# EAGLE design Radio (EAGLE 7.4.0)
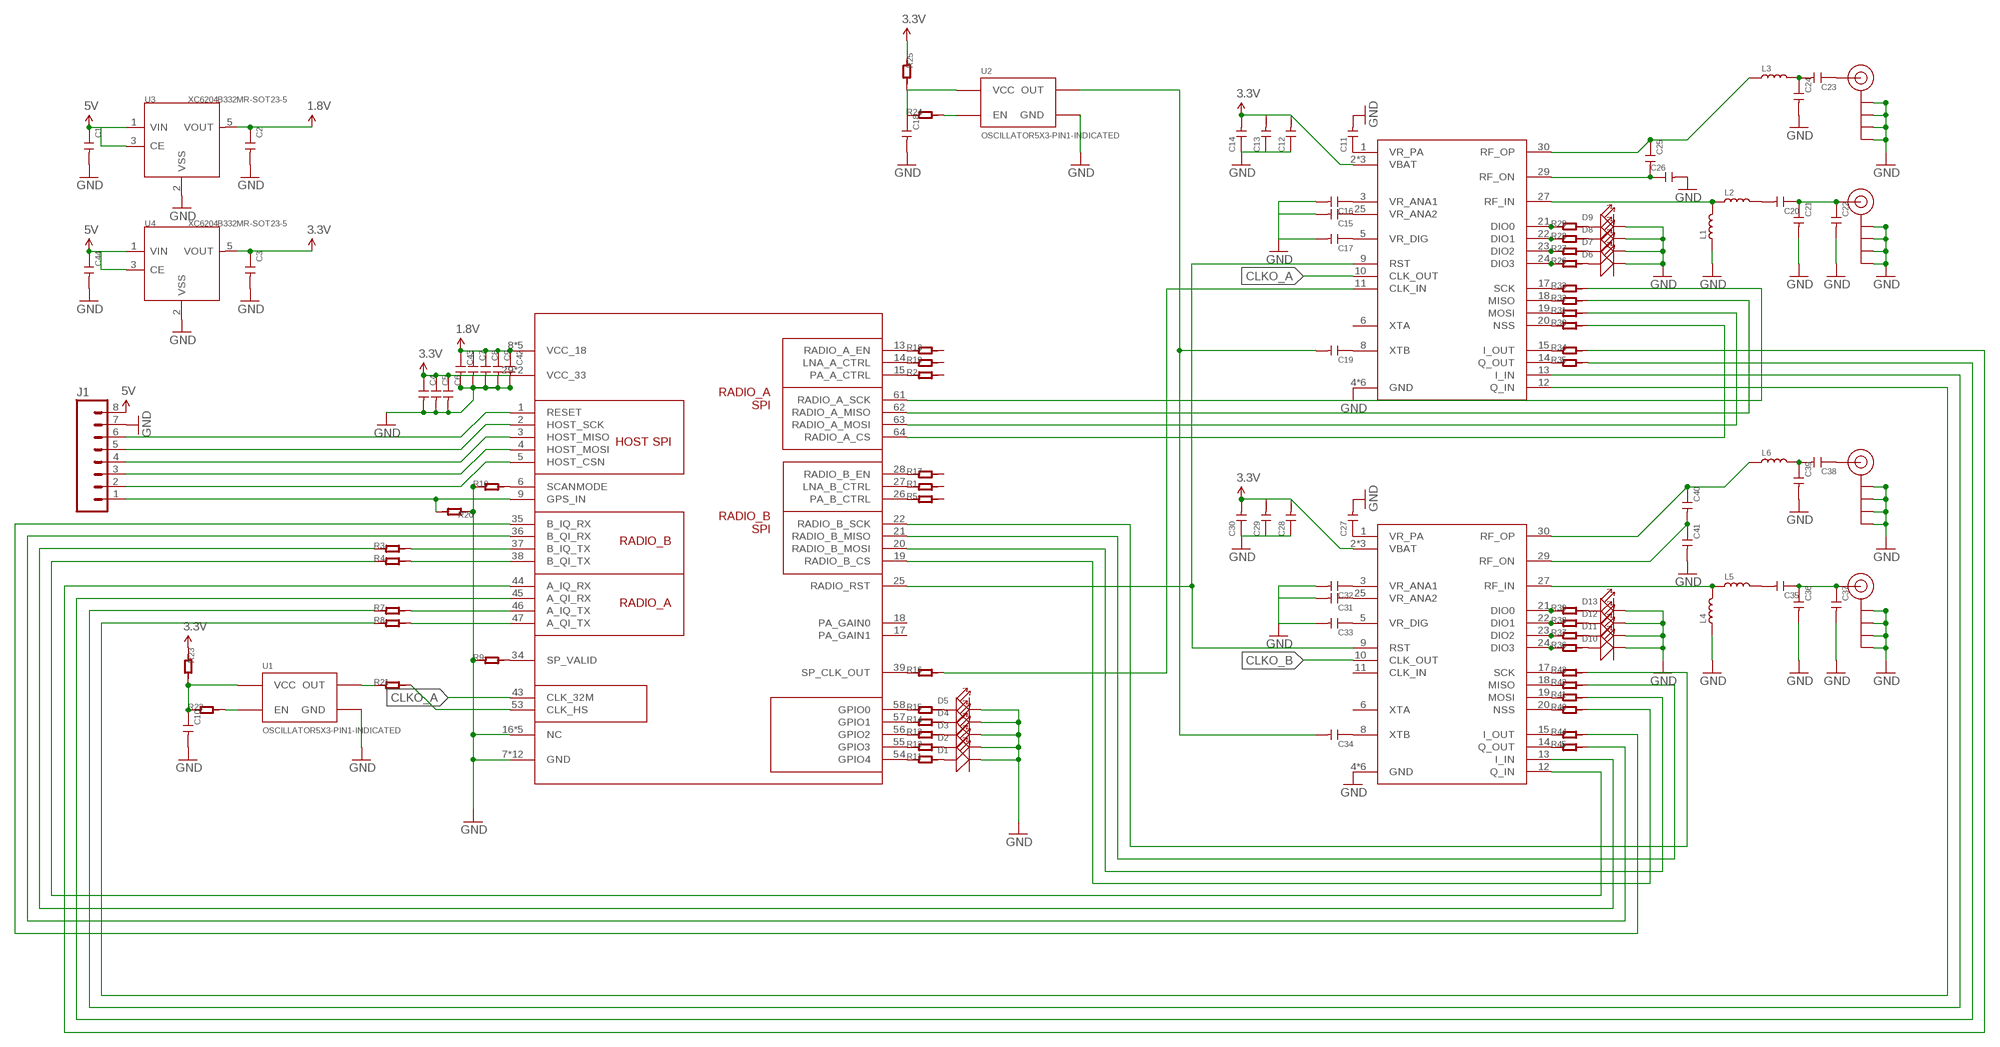
[diagram p0: schematic, sheet 1]

## Parts
C1  CAP-0603  [C0603]
C2  CAP-0402  [C0402]
C3  CAP-0603  [C0603]
C4  CAP-0402  [C0402]
C5  CAP-0805  [C0805]
C6  CAP-0402  [C0402]
C7  CAP-0402  [C0402]
C8  CAP-0402  [C0402]
C9  CAP-0402  [C0402]
C10  CAP-0402  [C0402]
C11  CAP-0402  [C0402]
C12  CAP-0402  [C0402]
C13  CAP-0402  [C0402]
C14  CAP-0402  [C0402]
C15  CAP-0402  [C0402]
C16  CAP-0402  [C0402]
C17  CAP-0402  [C0402]
C18  CAP-0402  [C0402]
C19  CAP-0402  [C0402]
C20  CAP-0402  [C0402]
C21  CAP-0402  [C0402]
C22  CAP-0402  [C0402]
C23  CAP-0402  [C0402]
C24  CAP-0402  [C0402]
C25  CAP-0402  [C0402]
C26  CAP-0402  [C0402]
C27  CAP-0402  [C0402]
C28  CAP-0402  [C0402]
C29  CAP-0402  [C0402]
C30  CAP-0402  [C0402]
C31  CAP-0402  [C0402]
C32  CAP-0402  [C0402]
C33  CAP-0402  [C0402]
C34  CAP-0402  [C0402]
C35  CAP-0402  [C0402]
C36  CAP-0402  [C0402]
C37  CAP-0402  [C0402]
C38  CAP-0402  [C0402]
C39  CAP-0402  [C0402]
C40  CAP-0402  [C0402]
C41  CAP-0402  [C0402]
C42  CAP-0402  [C0402]
C43  CAP-0402  [C0402]
C44  CAP-0402  [C0402]
D1  LED-0402  [LED-0402]
D2  LED-0402  [LED-0402]
D3  LED-0402  [LED-0402]
D4  LED-0402  [LED-0402]
D5  LED-0402  [LED-0402]
D6  LED-0402  [LED-0402]
D7  LED-0402  [LED-0402]
D8  LED-0402  [LED-0402]
D9  LED-0402  [LED-0402]
D10  LED-0402  [LED-0402]
D11  LED-0402  [LED-0402]
D12  LED-0402  [LED-0402]
D13  LED-0402  [LED-0402]
J1  M08LOCK  [1X08_LOCK]
J$1  SMA_EDGE  [SMA-EDGE]
J$2  SMA_EDGE  [SMA-EDGE]
J$3  SMA_EDGE  [SMA-EDGE]
J$4  SMA_EDGE  [SMA-EDGE]
L1  INDUCTOR/FERRITE-BEAD-0402  [L0402]
L2  INDUCTOR/FERRITE-BEAD-0402  [L0402]
L3  INDUCTOR/FERRITE-BEAD-0402  [L0402]
L4  INDUCTOR/FERRITE-BEAD-0402  [L0402]
L5  INDUCTOR/FERRITE-BEAD-0402  [L0402]
L6  INDUCTOR/FERRITE-BEAD-0402  [L0402]
R1  R-0402  [R0402]
R2  R-0402  [R0402]
R3  R-0402  [R0402]
R4  R-0402  [R0402]
R5  R-0402  [R0402]
R7  R-0402  [R0402]
R8  R-0402  [R0402]
R9  R-0402  [R0402]
R10  R-0402  [R0402]
R11  R-0402  [R0402]
R12  R-0402  [R0402]
R13  R-0402  [R0402]
R14  R-0402  [R0402]
R15  R-0402  [R0402]
R16  R-0402  [R0402]
R17  R-0402  [R0402]
R18  R-0402  [R0402]
R19  R-0402  [R0402]
R20  R-0402  [R0402]
R21  R-0402  [R0402]
R22  R-0402  [R0402]
R23  R-0402  [R0402]
R24  R-0402  [R0402]
R25  R-0402  [R0402]
R26  R-0402  [R0402]
R27  R-0402  [R0402]
R28  R-0402  [R0402]
R29  R-0402  [R0402]
R30  R-0402  [R0402]
R31  R-0402  [R0402]
R32  R-0402  [R0402]
R33  R-0402  [R0402]
R34  R-0402  [R0402]
R35  R-0402  [R0402]
R36  R-0402  [R0402]
R37  R-0402  [R0402]
R38  R-0402  [R0402]
R39  R-0402  [R0402]
R40  R-0402  [R0402]
R41  R-0402  [R0402]
R42  R-0402  [R0402]
R43  R-0402  [R0402]
R44  R-0402  [R0402]
R45  R-0402  [R0402]
U1  OSCILLATOR5X3-PIN1-INDICATED  [CRYSTAL-OSC-SMD-5X3]
U2  OSCILLATOR5X3-PIN1-INDICATED  [CRYSTAL-OSC-SMD-5X3]
U3  XC6204B332MR-SOT23-5  PMIC-XC6204B332MR(SOT23-5)  [SOT-23-5]
U4  XC6204B332MR-SOT23-5  PMIC-XC6204B332MR(SOT23-5)  [SOT-23-5]
U$1  SX1301  [QFN64G-0.5-9X9MM]
U$2  SX1255  [QFN32G-0.5-5X5MM]
U$3  SX1255  [QFN32G-0.5-5X5MM]

## Nets
1.8V: C2.1 C7.1 C8.1 C9.1 C42.1 C43.1 U3.5(VOUT) U$1.8(VCC_18) U$1.12(VCC_18) U$1.23(VCC_18) U$1.42(VCC_18) U$1.60(VCC_18)
3.3V: C3.1 C4.1 C5.1 C6.1 C12.2 C13.2 C14.2 C28.2 C29.2 C30.2 R23.1 R25.1 U4.5(VOUT) U$1.29(VCC_33) U$1.52(VCC_33) U$2.2(VBAT) U$2.16(VBAT) U$2.32(VBAT) U$3.2(VBAT) U$3.16(VBAT) U$3.32(VBAT)
5V: C1.1 C44.1 J1.8 U3.1(VIN) U3.3(CE) U4.1(VIN) U4.3(CE)
CLKO_A: U$1.43(CLK_32M) U$2.10(CLK_OUT)
CLKO_B: U$3.10(CLK_OUT)
CS: J1.2 U$1.5(HOST_CSN)
GND: C1.2 C2.2 C3.2 C4.2 C5.2 C6.2 C7.2 C8.2 C9.2 C10.2 C11.2 C12.1 C13.1 C14.1 C15.2 C16.2 C17.2 C18.2 C21.2 C22.2 C24.2 C26.2 C27.2 C28.1 C29.1 C30.1 C31.2 C32.2 C33.2 C36.2 C37.2 C39.2 C41.2 C42.2 C43.2 C44.2 D1.- D2.- D3.- D4.- D5.- D6.- D7.- D8.- D9.- D10.- D11.- D12.- D13.- J1.7 J$1.GND@0(GND) J$1.GND@1(GND) J$1.GND@2(GND) J$1.GND@3(GND) J$2.GND@0(GND) J$2.GND@1(GND) J$2.GND@2(GND) J$2.GND@3(GND) J$3.GND@0(GND) J$3.GND@1(GND) J$3.GND@2(GND) J$3.GND@3(GND) J$4.GND@0(GND) J$4.GND@1(GND) J$4.GND@2(GND) J$4.GND@3(GND) L1.1 L4.1 R9.1 R10.1 R20.1 U1.2(GND) U2.2(GND) U3.2(VSS) U4.2(VSS) U$1.7(GND) U$1.10(GND) U$1.11(GND) U$1.16(NC) U$1.24(GND) U$1.30(GND) U$1.31(GND) U$1.32(NC) U$1.33(NC) U$1.40(GND) U$1.41(GND) U$1.48(NC) U$1.49(NC) U$1.50(GND) U$1.51(GND) U$1.59(GND) U$1.65(GND) U$2.4(GND) U$2.7(GND) U$2.26(GND) U$2.28(GND) U$2.31(GND) U$2.33(GND) U$3.4(GND) U$3.7(GND) U$3.26(GND) U$3.28(GND) U$3.31(GND) U$3.33(GND)
MISO: J1.4 U$1.3(HOST_MISO)
MOSI: J1.3 U$1.4(HOST_MOSI)
N$1: R30.1 U$2.20(NSS)
N$2: R45.2 U$1.36(B_QI_RX)
N$3: R3.2 U$1.37(B_IQ_TX)
N$4: R4.2 U$1.38(B_QI_TX)
N$5: R34.2 U$1.44(A_IQ_RX)
N$6: R7.2 U$1.46(A_IQ_TX)
N$7: R8.2 U$1.47(A_QI_TX)
N$8: R35.2 U$1.45(A_QI_RX)
N$9: R9.2 U$1.34(SP_VALID)
N$10: R10.2 U$1.6(SCANMODE)
N$11: R1.1 U$1.27(LNA_B_CTRL)
N$12: R11.1 U$1.54(GPIO4)
N$13: R12.1 U$1.55(GPIO3)
N$14: R13.1 U$1.56(GPIO2)
N$15: R14.1 U$1.57(GPIO1)
N$16: R15.1 U$1.58(GPIO0)
N$17: D1.+ R11.2
N$18: D2.+ R12.2
N$19: D4.+ R14.2
N$20: D5.+ R15.2
N$21: D3.+ R13.2
N$22: R16.1 U$1.39(SP_CLK_OUT)
N$23: R17.1 U$1.28(RADIO_B_EN)
N$24: R18.1 U$1.13(RADIO_A_EN)
N$25: R2.1 U$1.15(PA_A_CTRL)
N$26: R19.1 U$1.14(LNA_A_CTRL)
N$27: R5.1 U$1.26(PA_B_CTRL)
N$29: C19.1 U$2.8(XTB)
N$30: R21.2 U$1.53(CLK_HS)
N$31: R21.1 U1.3(OUT)
N$32: R22.2 U1.1(EN)
N$33: C10.1 R22.1 R23.2 U1.4(VCC)
N$34: R24.2 U2.1(EN)
N$35: C11.1 U$2.1(VR_PA)
N$36: C18.1 R24.1 R25.2 U2.4(VCC)
N$37: C19.2 C34.2 U2.3(OUT)
N$38: C15.1 U$2.25(VR_ANA2)
N$39: C16.1 U$2.3(VR_ANA1)
N$40: C17.1 U$2.5(VR_DIG)
N$41: R26.1 U$2.24(DIO3)
N$42: R27.1 U$2.23(DIO2)
N$43: R28.1 U$2.22(DIO1)
N$44: R29.1 U$2.21(DIO0)
N$45: D6.+ R26.2
N$46: D8.+ R28.2
N$47: D9.+ R29.2
N$48: D7.+ R27.2
N$49: L1.2 L2.1 U$2.27(RF_IN)
N$50: C20.2 L2.2
N$51: C20.1 C21.1 C22.1 J$1.SIG(SIGNAL)
N$52: C23.2 C24.1 L3.2
N$53: C25.1 L3.1 U$2.30(RF_OP)
N$54: C25.2 C26.1 U$2.29(RF_ON)
N$55: C23.1 J$2.SIG(SIGNAL)
N$56: R34.1 U$2.15(I_OUT)
N$57: R35.1 U$2.14(Q_OUT)
N$58: C27.1 U$3.1(VR_PA)
N$59: C31.1 U$3.25(VR_ANA2)
N$60: C32.1 U$3.3(VR_ANA1)
N$61: C33.1 U$3.5(VR_DIG)
N$62: C34.1 U$3.8(XTB)
N$63: R36.1 U$3.24(DIO3)
N$64: R37.1 U$3.23(DIO2)
N$65: R38.1 U$3.22(DIO1)
N$66: R39.1 U$3.21(DIO0)
N$67: D10.+ R36.2
N$68: D12.+ R38.2
N$69: D13.+ R39.2
N$70: D11.+ R37.2
N$71: L4.2 L5.1 U$3.27(RF_IN)
N$72: C35.2 L5.2
N$73: C35.1 C36.1 C37.1 J$3.SIG(SIGNAL)
N$74: C38.2 C39.1 L6.2
N$75: C40.1 L6.1 U$3.30(RF_OP)
N$76: C40.2 C41.1 U$3.29(RF_ON)
N$77: C38.1 J$4.SIG(SIGNAL)
N$78: R44.1 U$3.15(I_OUT)
N$79: R45.1 U$3.14(Q_OUT)
N$80: R33.2 U$1.61(RADIO_A_SCK)
N$81: R32.2 U$1.62(RADIO_A_MISO)
N$82: R31.2 U$1.63(RADIO_A_MOSI)
N$83: R30.2 U$1.64(RADIO_A_CS)
N$84: R43.2 U$1.22(RADIO_B_SCK)
N$85: R42.2 U$1.21(RADIO_B_MISO)
N$86: R41.2 U$1.20(RADIO_B_MOSI)
N$87: R40.2 U$1.19(RADIO_B_CS)
N$88: U$1.25(RADIO_RST) U$2.9(RST) U$3.9(RST)
N$89: R16.2 U$2.11(CLK_IN)
N$90: R44.2 U$1.35(B_IQ_RX)
N$91: R7.1 U$2.13(I_IN)
N$92: R3.1 U$3.13(I_IN)
N$93: R4.1 U$3.12(Q_IN)
N$94: R8.1 U$2.12(Q_IN)
N$100: R31.1 U$2.19(MOSI)
N$101: R32.1 U$2.18(MISO)
N$102: R33.1 U$2.17(SCK)
N$103: R40.1 U$3.20(NSS)
N$104: R41.1 U$3.19(MOSI)
N$105: R42.1 U$3.18(MISO)
N$106: R43.1 U$3.17(SCK)
PPS: J1.1 R20.2 U$1.9(GPS_IN)
RST: J1.6 U$1.1(RESET)
SCK: J1.5 U$1.2(HOST_SCK)
Unconnected: R1.2 R2.2 R5.2 R17.2 R18.2 R19.2 U$1.17(PA_GAIN1) U$1.18(PA_GAIN0) U$2.6(XTA) U$3.6(XTA) U$3.11(CLK_IN)

## Library data of the parts
C1-C44 = Discrete:CAP: Ceramic Capacitors
D1-D13 = Discrete:LED
J1 = SparkFun-Connectors:M08: Header 8 Standard 8-pin 0.1" header. Use with straight break away headers (SKU : PRT-00116), right angle break away headers (PRT-00553), swiss pins (PRT-00743), machine pins (PRT-00117), and female headers (PRT-00115).
J$1-J$4 = SparkFun-Connectors:SMA_EDGE: SMA Antenna Connector End launch SMA connector. The paste layer has been removed so that the connector can be hand soldered onto the board after reflow.
L1-L6 = Discrete:INDUCTOR/FERRITE-BEAD
R1-R5 R7-R45 = Discrete:R*
U1 U2 = SparkFun-FreqCtrl:OSCILLATOR: Generic 5x3 and 7x5 oscillators
U3 U4 = Seeed-OPL-ic:PMIC-XC6204B332MR(SOT23-5): 310030106; MPN: XC6204B332MR
U$1 = Seeed-OPL-ic:SX1301
U$2 U$3 = Seeed-OPL-ic:SX1255

## Board
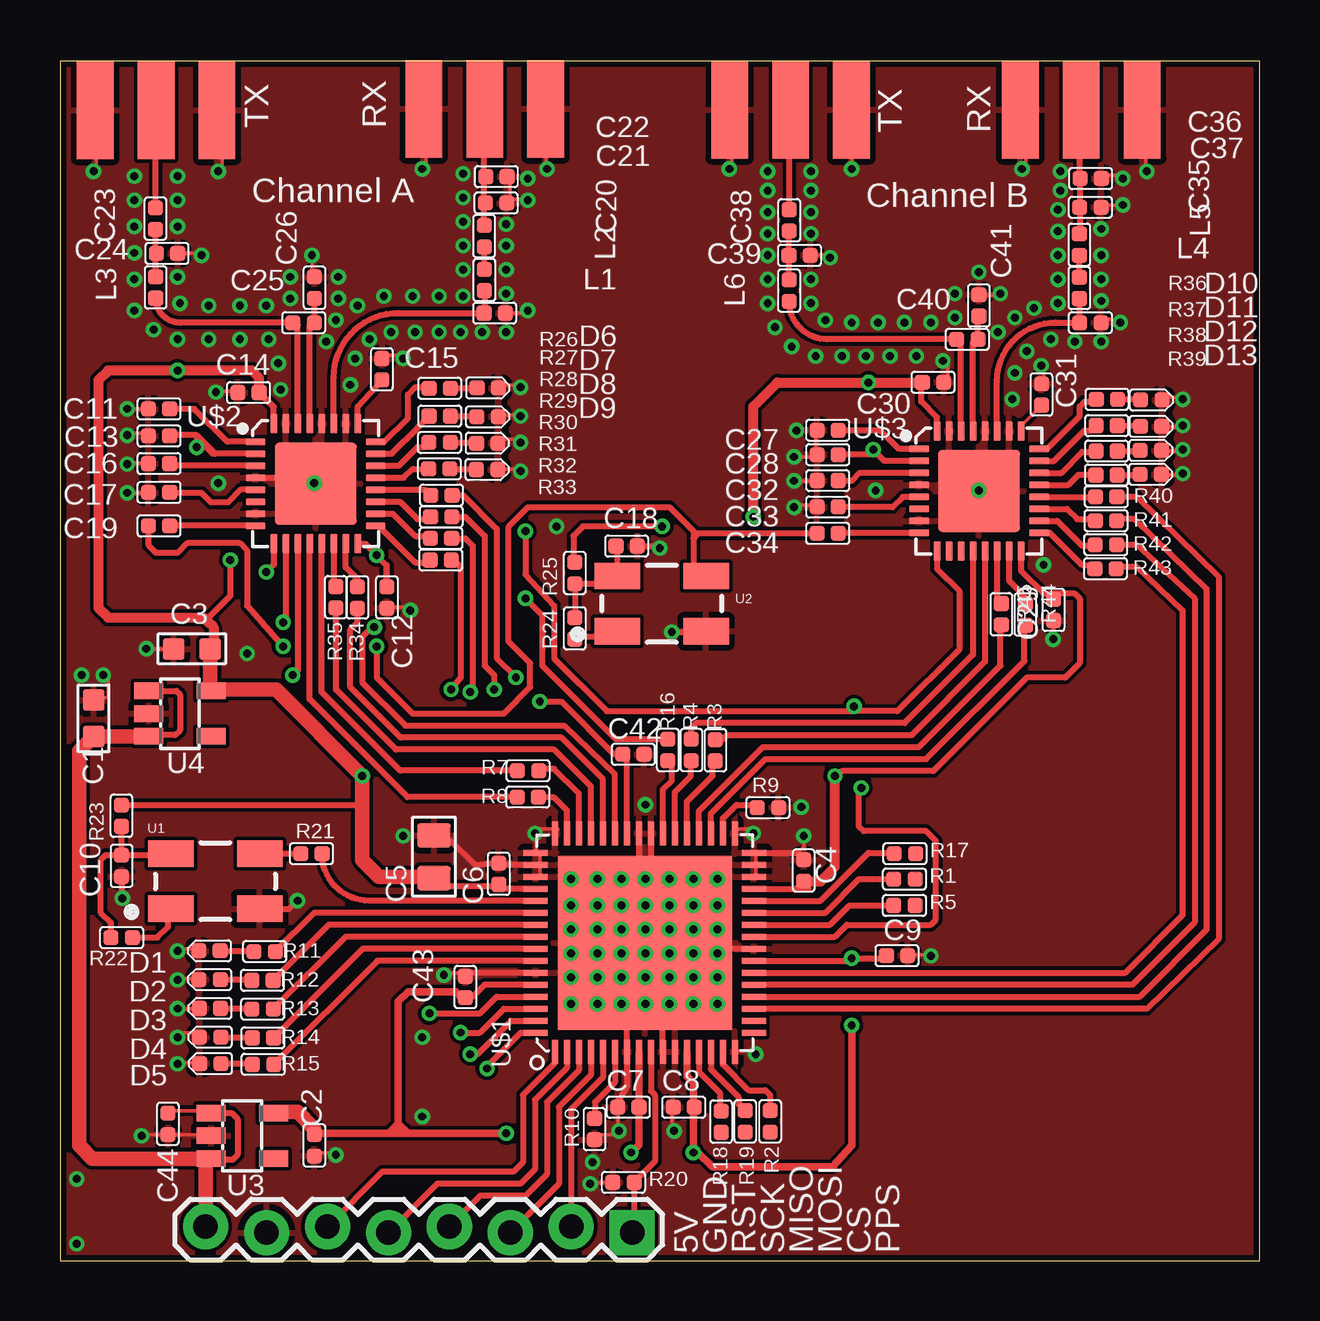
[diagram p1: board, top side]
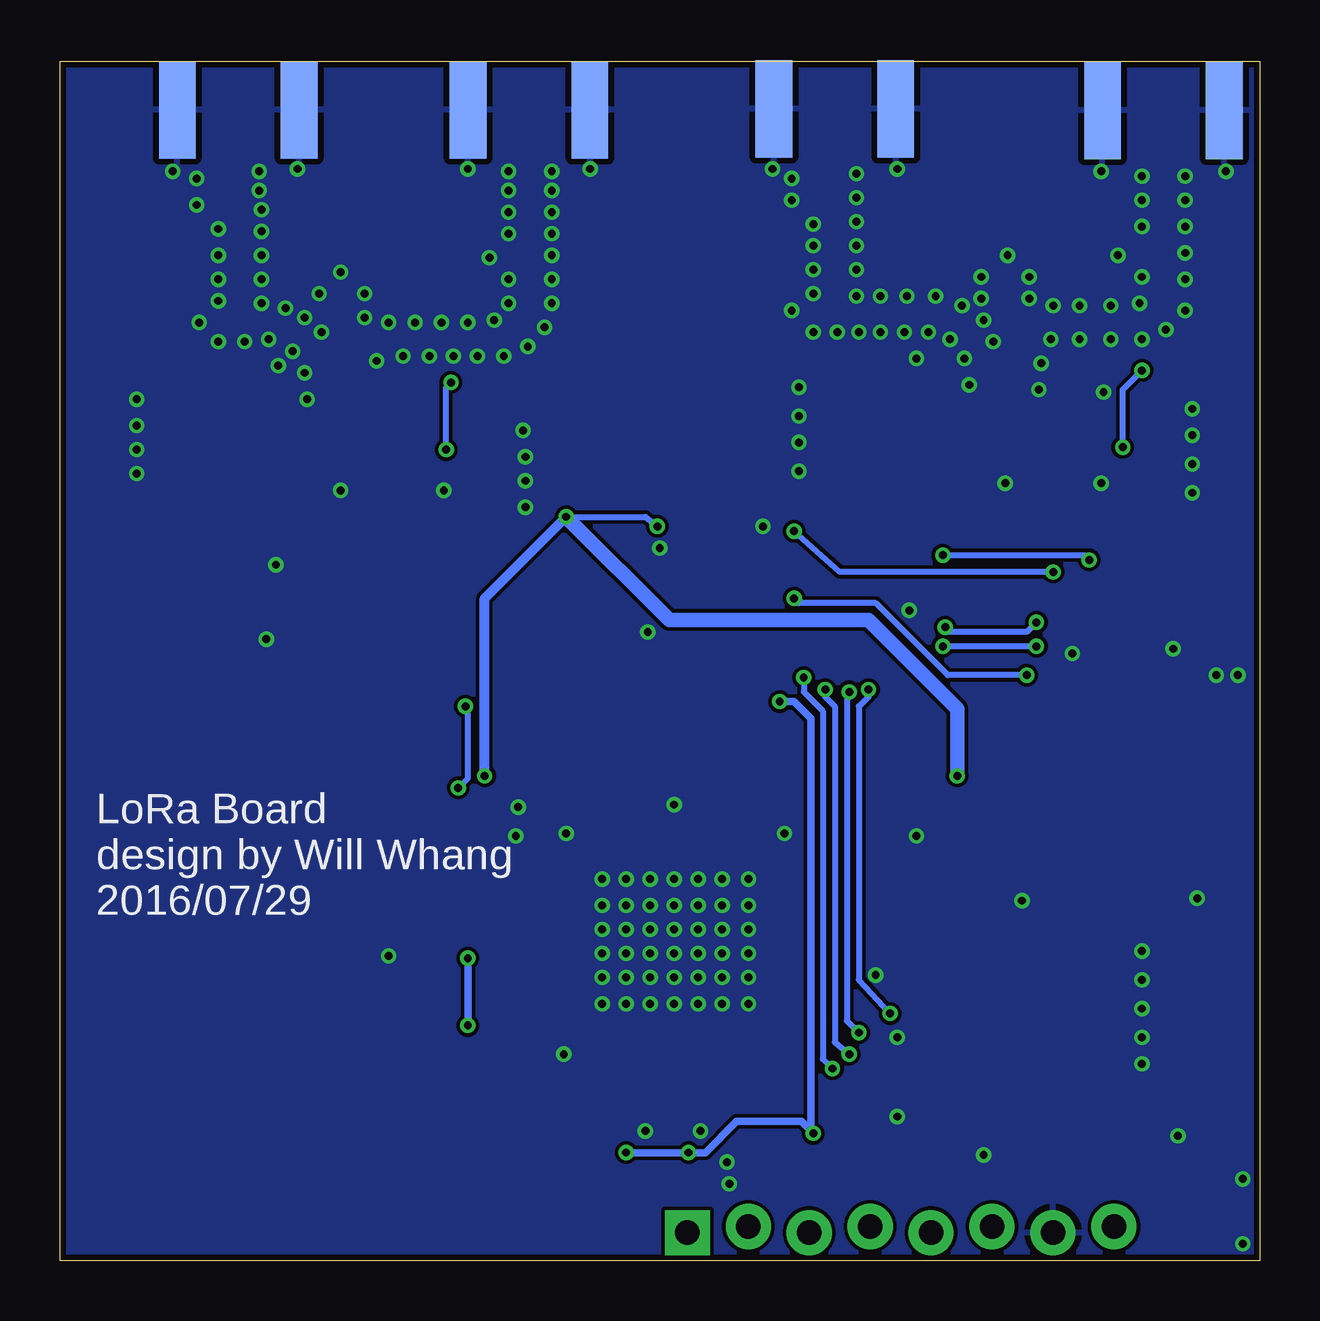
[diagram p2: board, bottom side, seen from below]

Size 50 x 50 mm. Coordinates in mm from the lower left corner, seen from the top.
Outline: 0,0 50,0 50,50 0,50 0,0
Copper layers (1*16): Top 0.035mm / dielectric 1.5mm / Bottom 0.035mm
Design rules "SeeedStudio_2layer_DRU_no_angle_20140221": minimum track width 6mil, minimum drill 12mil, track to track 6mil, track to pad 6mil, pad to pad 6mil, via to via 6mil, smd to smd 0mil, copper to edge 10mil, drill to drill 10mil, minimum pad ring 10mil, minimum via ring 6mil, stop-mask expansion 2mil, vias tented up to drill 100mil, thermal gap 10mil

### Footprints (pad centres in the part's own frame; a part is rotated, then mirrored left to right if it is on the bottom)
C0603 = smd 0.889 x 0.889: 1 -0.762,0; 2 0.762,0
C0402 = smd 0.635 x 0.635: 1 -0.445,0; 2 0.445,0
C0805 = smd 1.016 x 1.397: 1 -0.889,0; 2 0.889,0
LED-0402 = smd 0.635 x 0.635: + -0.445,0; - 0.445,0
1X08_LOCK = drill 1.016 pad 1.88 square: 1 0,0.127 | drill 1.016 pad 1.88: 2 2.54,-0.127; 3 5.08,0.127; 4 7.62,-0.127; 5 10.16,0.127; 6 12.7,-0.127; 7 15.24,0.127; 8 17.78,-0.127
SMA-EDGE = smd 1.524 x 4.064: GND@0 0,0; GND@1 5.08,0; SIG 2.54,0 | smd 1.524 x 4.064 bottom: GND@2 0,0; GND@3 5.08,0
L0402 = smd 0.635 x 0.635: 1 -0.445,0; 2 0.445,0
R0402 = smd 0.635 x 0.635: 1 -0.445,0; 2 0.445,0
CRYSTAL-OSC-SMD-5X3 = smd 1.9 x 1.1: 1 -1.85,-1.15; 2 1.85,-1.15; 3 1.85,1.15; 4 -1.85,1.15
SOT-23-5 = smd 0.69 x 1.2: 1 -0.95,-1.3; 2 0,-1.3; 3 0.95,-1.3; 4 0.95,1.3; 5 -0.95,1.3
QFN64G-0.5-9X9MM = smd 1 x 0.25: 1 -4.55,3.75; 2 -4.55,3.25; 3 -4.55,2.75; 4 -4.55,2.25; 5 -4.55,1.75; 6 -4.55,1.25; 7 -4.55,0.75; 8 -4.55,0.25; 9 -4.55,-0.25; 10 -4.55,-0.75; 11 -4.55,-1.25; 12 -4.55,-1.75; 13 -4.55,-2.25; 14 -4.55,-2.75; 15 -4.55,-3.25; 16 -4.55,-3.75; 33 4.55,-3.75; 34 4.55,-3.25; 35 4.55,-2.75; 36 4.55,-2.25; 37 4.55,-1.75; 38 4.55,-1.25; 39 4.55,-0.75; 40 4.55,-0.25; 41 4.55,0.25; 42 4.55,0.75; 43 4.55,1.25; 44 4.55,1.75; 45 4.55,2.25; 46 4.55,2.75; 47 4.55,3.25; 48 4.55,3.75 | smd 0.25 x 1: 17 -3.75,-4.55; 18 -3.25,-4.55; 19 -2.75,-4.55; 20 -2.25,-4.55; 21 -1.75,-4.55; 22 -1.25,-4.55; 23 -0.75,-4.55; 24 -0.25,-4.55; 25 0.25,-4.55; 26 0.75,-4.55; 27 1.25,-4.55; 28 1.75,-4.55; 29 2.25,-4.55; 30 2.75,-4.55; 31 3.25,-4.55; 32 3.75,-4.55; 49 3.75,4.55; 50 3.25,4.55; 51 2.75,4.55; 52 2.25,4.55; 53 1.75,4.55; 54 1.25,4.55; 55 0.75,4.55; 56 0.25,4.55; 57 -0.25,4.55; 58 -0.75,4.55; 59 -1.25,4.55; 60 -1.75,4.55; 61 -2.25,4.55; 62 -2.75,4.55; 63 -3.25,4.55; 64 -3.75,4.55 | smd 7.25 x 7.25: 65 0,0
QFN32G-0.5-5X5MM = smd 0.813 x 0.279: 1 -2.5,1.75; 2 -2.5,1.25; 3 -2.5,0.75; 4 -2.5,0.25; 5 -2.5,-0.25; 6 -2.5,-0.75; 7 -2.5,-1.25; 8 -2.5,-1.75; 17 2.5,-1.75; 18 2.5,-1.25; 19 2.5,-0.75; 20 2.5,-0.25; 21 2.5,0.25; 22 2.5,0.75; 23 2.5,1.25; 24 2.5,1.75 | smd 0.279 x 0.813: 9 -1.75,-2.5; 10 -1.25,-2.5; 11 -0.75,-2.5; 12 -0.25,-2.5; 13 0.25,-2.5; 14 0.75,-2.5; 15 1.25,-2.5; 16 1.75,-2.5; 25 1.75,2.5; 26 1.25,2.5; 27 0.75,2.5; 28 0.25,2.5; 29 -0.25,2.5; 30 -0.75,2.5; 31 -1.25,2.5; 32 -1.75,2.5 | smd 3.429 x 3.429: 33 0,0

### Placement (x,y rotation side)
C1  1.4,22.6 90 top
C2  10.6,4.8 270 top
C3  5.5,25.5 180 top
C4  31,16.26 90 top
C5  15.59,16.83 90 top
C6  18.29,16.12 90 top
C7  23.69,6.39 180 top
C8  26,6.39 180 top
C9  34.89,12.71 0 top
C10  2.57,16.45 270 top
C11  4.13,35.5 180 top
C12  13.63,27.64 90 top
C13  4.13,34.37 0 top
C14  7.86,36.18 0 top
C15  13.42,37.15 90 top
C16  4.13,33.22 180 top
C17  4.13,32.02 180 top
C18  23.62,29.78 0 top
C19  4.13,30.62 180 top
C20  17.68,42.7 270 top
C21  18.19,45.18 0 top
C22  18.18,44.08 0 top
C23  3.98,43.43 270 top
C24  4.46,41.98 0 top
C25  10.16,39.09 0 top
C26  10.61,40.55 90 top
C27  32,34.61 180 top
C28  32,33.59 0 top
C29  41.41,27.12 90 top
C30  36.39,36.61 180 top
C31  40.91,36.1 90 top
C32  32,32.51 180 top
C33  32,31.41 180 top
C34  32,30.31 180 top
C35  42.49,42.34 270 top
C36  42.96,45.1 0 top
C37  42.95,43.9 0 top
C38  30.4,43.36 270 top
C39  30.83,41.9 0 top
C40  37.82,38.4 0 top
C41  38.3,39.81 90 top
C42  23.9,21.1 0 top
C43  16.9,11.4 90 top
C44  4.5,5.7 270 top
D1  6.23,12.91 180 top
D2  6.24,11.71 180 top
D3  6.25,10.51 180 top
D4  6.26,9.31 180 top
D5  6.27,8.21 180 top
D6  17.83,36.37 0 top
D7  17.82,35.17 0 top
D8  17.81,34.07 0 top
D9  17.8,32.97 0 top
D10  45.49,35.87 0 top
D11  45.48,34.77 0 top
D12  45.47,33.77 0 top
D13  45.46,32.77 0 top
J1  23.85,1.29 180 top
J$1  15.16,48.01 0 top
J$2  6.55,47.94 180 top
J$3  40.03,47.96 0 top
J$4  27.91,47.96 0 top
L1  18.12,39.49 180 top
L2  17.69,40.87 90 top
L3  3.99,40.56 90 top
L4  42.95,39.09 180 top
L5  42.49,40.54 90 top
L6  30.39,40.43 90 top
R1  35.2,15.9 0 top
R2  29.6,5.8 270 top
R3  27.32,21.27 270 top
R4  26.32,21.28 270 top
R5  35.2,14.8 0 top
R7  19.51,20.42 0 top
R8  19.5,19.32 0 top
R9  29.51,18.88 180 top
R10  22.28,5.48 90 top
R11  8.53,12.88 180 top
R12  8.44,11.68 180 top
R13  8.45,10.48 180 top
R14  8.46,9.28 180 top
R15  8.47,8.18 180 top
R16  25.34,21.28 90 top
R17  35.22,16.96 0 top
R18  27.56,5.79 270 top
R19  28.56,5.8 270 top
R20  23.49,3.26 0 top
R21  10.48,16.96 0 top
R22  2.57,13.46 0 top
R23  2.56,18.54 270 top
R24  21.46,26.35 270 top
R25  21.46,28.66 270 top
R26  15.83,36.36 0 top
R27  15.83,35.2 0 top
R28  15.82,34.1 0 top
R29  15.81,33 0 top
R30  15.9,31.9 0 top
R31  15.89,31 0 top
R32  15.88,30.1 0 top
R33  15.87,29.2 0 top
R34  12.4,27.64 270 top
R35  11.5,27.65 270 top
R36  43.64,35.9 0 top
R37  43.63,34.8 0 top
R38  43.63,33.74 0 top
R39  43.62,32.74 0 top
R40  43.61,31.84 0 top
R41  43.6,30.84 0 top
R42  43.59,29.84 0 top
R43  43.58,28.84 0 top
R44  40.24,26.93 270 top
R45  39.24,26.94 270 top
U1  6.48,15.81 0 top
U2  25.08,27.38 0 top
U3  7.6,5.2 270 top
U4  5,22.8 270 top
U$1  24.38,13.25 90 top
U$2  10.66,32.38 0 top
U$3  38.31,32.08 0 top

### Tracks (layer width: path | path; a pad name or v marks a point on that pad's centre or on a via)
1.8V  (via drill 0.33)
  Top 0.254: 26.4,7.4 26.4,6.43 C8.1 | U$1.8 C7.1 | U$1.60 17.7,11.5 17.2,11 16.96,11 C43.1 | U$1.42 23.63,20.93 C42.1 23.1,21.1 20.9,23.3 v20,23.3 | U$1.23 32.8,12.5 v33,12.6 34.4,12.6 34.44,12.64 34.44,12.7 C9.1
  Top 0.305: C43.1 16.74,10.96 16.5,11.2 14.5,11.2 14.1,10.8 14.1,5.7 | 14.1,5.7 13.7,5.3 | 13.7,5.3 14.4,5.3 | 14.5,5.3 14.4,5.3 | 14.4,5.3 14.1,5.6 14.1,5.7 | 14.1,5.7 14.5,5.3 | 13.7,5.3 10.65,5.3 C2.1 | U$1.8 24.13,4.83 v23.8,4.5 | v18.6,5.3 14.5,5.3 | 26.4,4.7 26.4,7.4 26.13,7.67 U$1.12 | 26.4,4.7 v26.4,4.5 26.6,4.5 | 26.4,4.7 26.6,4.5 | 26.6,4.5 27.2,3.9 32.2,3.9 33,4.8 v33,9.8
  Top 0.61: C2.1 10.6,5.5 9.9,6.2 8.95,6.2 U3.5
  Bottom 0.305: 18.7,5.4 19.1,5.8 21.8,5.8 23.1,4.5 v23.8,4.5 v26.4,4.5 | v33,9.8 v33,12.6 | v20,23.3 19.4,23.3 18.7,22.6 18.7,5.4 | 18.7,5.4 v18.6,5.3
3.3V  (via drill 0.33)
  Top 0.254: C6.1 18.37,15.5 U$1.52 18.3,15.5 18.3,15.6 15.8,15.6 | C5.1 15.65,15.57 15.78,15.57 15.8,15.6 | C4.1 30.68,15.5 U$1.29 31.2,15.5 31.2,15.9 31.1,15.9 31,15.8 | 15.8,15.6 15.5,15.6 15.1,16 | C13.2 4.6,34.4 5.7,34.4 6.47,33.63 U$2.2 6.37,33.63 6.1,33.9 | 34.1,33.6 34.37,33.33 U$3.2 | 34.1,33.6 33.7,33.6 | 33.7,33.6 32.45,33.6 C28.2 | C14.2 8.91,35.58 U$2.32 8.91,35.59 8.3,36.2 | 6.1,33.9 5.7,34.3 v5.7,33.9 6.1,33.9 | U$2.16 12.72,29.88 v13.2,29.4 13.6,29 | 13.6,29 13.6,28.11 C12.2 13.63,28.97 13.6,29 | v7.1,29.2 7.1,27.7 6.1,26.7 6.2,26.6 | 34.1,33.6 v33.9,33.8 33.7,33.6 | U$3.32 36.56,35.14 35.9,35.8 35.9,36.56 C30.2 | v25.1,30.6 21.8,30.6 21.4,30.2 21.4,29.16 R25.1 | 41.4,27.8 41.5,27.47 C29.2 | U$3.16 40.06,28.74 41,27.8 41.4,27.8 | 41.4,27.8 42.3,27.8 42.5,27.6 42.5,24.9 41.9,24.3 40.3,24.3 36.4,20.4 32.6,20.4 v32.3,20.2 32.4,20.2 | R23.1 12.59,18.98 v12.6,20.2
  Top 0.406: 8.3,36.2 8.3,36.8 8,37.1 v4.9,37.1 2,37.1 1.6,36.7 1.6,27.2 2,26.8 6,26.8 6.2,26.6 6.4,26.4 6.4,25.64 C3.1 | 31,15.8 31.7,15.8 32.3,16.4 v32.3,20.2 | v28.9,31 28.9,35.6 29.9,36.6 v33.7,36.6 35.94,36.6 C30.2
  Top 0.61: 15.1,16 13.3,16 12.6,16.7 v12.6,20.2 9,23.8 6.35,23.8 U4.5 6.26,23.79 C3.1
  Bottom 0.254: v5.7,33.9 5.7,36.3 v4.9,37.1 | v13.2,29.4 7.3,29.4 v7.1,29.2 | v33.9,33.8 33.9,36.4 v33.7,36.6 | v28.9,31 25.6,31 v25.1,30.6
  Bottom 0.406: v32.3,20.2 32.3,27.6 v28.9,31
  Bottom 0.61: v12.6,20.2 12.6,23 16.3,26.7 24.6,26.7 v28.9,31
5V
  Top 0.152: C44.1 4.5,6.25 6.25,6.25 U3.1
  Top 0.254: U4.1 4.85,23.75 5,23.6 5,22.1 4.8,21.9 3.75,21.9 U4.3 | U3.1 7.15,6.15 7.4,5.9 7.4,4.4 7.2,4.2 6.35,4.2 U3.3
  Top 0.61: J1.8 6.07,4.02 U3.3 1.35,4.25 0.8,4.8 0.8,21.24 C1.1 1.99,21.85 U4.3
CLKO_A  (via drill 0.33)
  Top 0.254: U$2.10 9.41,26.81 v9.3,26.6 | v13.1,26.4 13,26.4 12.6,26 12.6,24.1 14.4,22.3 21,22.3 23.13,20.27 U$1.43
  Bottom 0.254: v9.3,26.6 9.7,26.2 13,26.2 13.2,26.4 v13.1,26.4
CS
  Top 0.254: U$1.5 22.63,7.63 21.3,6.3 J1.2
GND  (via drill 0.33)
  Top 0.152: 20,16.5 20,16 U$1.51 | 20,16.5 20,17 U$1.49 19.85,17.1 19.85,17.65 v19.8,17.8 19.75,18 20.75,18 U$1.48 | 20,16.5 U$1.50 | 29,16.5 29,16 U$1.30 | 29,17 29,16.5 | 29,16.5 U$1.31 | 18.75,44.25 18.75,45 C21.2 | C27.2 31.5,34.5 31.5,33.75 C28.1 31.5,33.5 v30.6,33.5 | C2.2 10.75,4.5 11.5,4.5 v11.5,4.4 | R10.1 22.5,5.25 23.25,5.25 v23.3,5.4 23.25,5.5 23.25,6.25 C7.2 | R20.1 23,3.25 22.25,3.25 v22.1,3.2 | C44.2 3.5,5.25 v3.4,5.2 | D5.- 5.75,8.25 5,8.25 v4.9,8.2 | D4.- 5.75,9.5 5,9.5 v4.9,9.3 | v4.9,10.5 5.75,10.5 D3.- | D2.- 5.75,11.75 5,11.75 v4.9,11.7 | D1.- 5.75,13 5,13 v4.9,12.9 | C12.1 13.75,27.25 14.5,27.25 v14.6,27.1 | v2.8,32 3.5,32 C17.2 | C16.2 3.5,33.25 3,33.25 v2.8,33.2 | C13.1 3.5,34.5 3,34.5 v2.8,34.4 | v2.8,35.5 C11.2 | C14.1 7.25,36.25 6.5,36.25 v6.5,36.2 | C24.2 5,42 5.75,42 v5.9,41.9 | C9.2 35.5,12.75 36.25,12.75 v36.3,12.7 | C15.2 13.5,37.75 14.25,37.75 v14.3,37.6 | v10.5,41.9 10.5,41 C26.2 | D9.- 18.25,33 19,33 v19.2,32.9 | D8.- 18.5,34.25 19,34.25 v19.2,34.1 | D7.- 18.5,35.25 19,35.25 v19.2,35.2 | D6.- 18.5,36.5 19,36.5 v19.2,36.4 | L1.1 18.75,39.5 19.5,39.5 v19.5,39.6 | 30,18.75 R9.1 | 31,17.75 v31,17.7 31,17.25 30.75,17 30.7,17 | C29.1 41.4,26 v41.4,25.9 | C39.2 32,41.9 v32.1,41.8 | C33.2 31.5,31.5 30.75,31.5 v30.6,31.4 | v30.6,32.5 31.5,32.5 C32.2 | C30.1 37,36.75 37,37.5 v36.8,37.5 | C41.2 38.5,40.25 39,40.25 v39.2,40.3 | C31.2 41,36.75 41,37.15 v40.9,37.3 | D13.- 46,32.75 46.75,32.75 v46.8,32.8 | D12.- 46,33.75 46.75,33.75 v46.8,33.8 | D11.- 46,34.75 46.75,34.75 v46.8,34.8 | D10.- 46,36 46.75,36 v46.8,35.9 | L4.1 43.5,39.25 44,39.25 v44.2,39.1 | v44.3,44 43.5,44 C37.2 | C36.2 43.5,45.25 44.25,45.25 v44.3,45.1
  Top 0.152: v3.6,25.5 C3.2 | U$1.16 28.25,8.75 29,8.75 v29,8.6 | U$1.33 28.25,18 29,18 v28.9,17.8 | 18.75,44.25 19.5,44.25 v19.5,44.2 | 18.75,44.25 C22.2 | C44.2 6.25,5.25 U3.2 | C44.2 | C8.2 25.5,6.25 25.5,5.5 v25.6,5.4 | C1.2 2,23.5 2,24.5 v1.8,24.4 | C43.2 16.75,12 16.3,12 v16,11.9 | U$3.33 38.5,32.25 v38.3,32.1 | J$2.GND@3 1.5,47.75 1.5,45.5 v1.4,45.4 | J$2.GND@2 6.75,47.75 6.75,45.5 v6.6,45.4 | J$1.GND@2 15.25,48 15.25,45.5 v15.1,45.5 | J$1.GND@3 20.25,45.5 v20.3,45.5 | J$4.GND@2 28,47.75 28,45.5 v27.9,45.5 | v33,45.5 33,47.75 J$4.GND@3 | J$3.GND@2 40.25,47.75 40.25,45.5 v40.1,45.5 | J$3.GND@3 45.25,47.75 45.25,45.5 v45.3,45.4 | U$1.65 24.65,14.85 24.4,14.85 v24.4,14.8 | 24.38,10.85 24.65,12.85 24.4,12.85 v24.4,12.8 | 24.78,10.75 24.4,10.75 v24.4,10.7
  Top 0.254: 25.63,6.46 C8.2 | C7.2 23.3,6.25 23.3,6.7 23.63,7.23 U$1.7 23.63,11.53 24.4,12.3 24.9,12.3 25.1,12.1 25.1,8.73 U$1.10 | U$1.59 16.96,12 C43.2 | U$1.50 18.33,16.5 C6.2 17.34,16.46 16.3,17.5 15.51,17.5 C5.2 | U$1.32 29,17 30.7,17 C4.2 | U$2.4 10.37,32.63 v10.6,32.4 | C18.2 24.92,29.78 v25,29.7 | v25.5,26.2 26.9,26.2 U2.2 | C10.2 2.57,15.13 v2.6,15.1 | U1.2 9.56,14.66 v9.9,15 | U$1.24 24.53,13 U$1.65 24.63,13.5 U$1.40 | U$1.41 24.13,16.07 v24.4,15.9 | 24.13,14.17 v24.4,13.8 | 24.13,12.17 v24.4,11.8
  other vias: 6.6,32.4 11.1,38.3 12.1,36.5 19.5,45.1 30.7,34.6 39.7,35.9 41,29 34,32.1 9.1,37.4 21.3,15.9 22.4,15.9 23.4,15.9 25.4,15.9 26.4,15.9 27.4,15.9 21.3,14.8 22.4,14.8 23.4,14.8 25.4,14.8 26.4,14.8 27.4,14.8 14.3,17.7 22.2,4.1 0.9,24.4 24.4,19 21.3,13.8 22.4,13.8 23.4,13.8 25.4,13.8 26.4,13.8 27.4,13.8 21.3,12.8 22.4,12.8 23.4,12.8 25.4,12.8 26.4,12.8 27.4,12.8 21.3,11.8 22.4,11.8 23.4,11.8 25.4,11.8 26.4,11.8 27.4,11.8 21.3,10.7 22.4,10.7 23.4,10.7 25.4,10.7 26.4,10.7 27.4,10.7 30.9,18.9 4.9,41 5,39.9 6.2,39.8 7.5,39.8 8.6,39.8 9.6,40.1 9.6,41 11.6,41 11.6,40.1 11.5,39.2 8.7,38.4 9.2,36.3 7.5,38.4 6.2,38.4 4.9,38.4 3.9,38.8 3.1,39.6 3.1,40.9 3.1,42 3.1,43.1 3.1,44.2 3.1,45.2 4.9,45.2 4.9,44.2 4.9,43.1 12.3,37.6 12.9,38.4 13.8,38.7 14.8,38.7 15.8,38.7 16.7,38.7 17.6,38.7 18.6,38.7 12.4,39.8 13.5,40.2 14.7,40.2 15.8,40.2 16.8,40.2 18.6,40.3 18.6,41.3 18.6,42.3 16.8,41.3 16.8,42.3 16.8,43.3 16.8,44.3 16.8,45.3 18.6,43.2 29.5,45.4 29.5,44.6 29.5,43.7 29.5,42.8 29.5,41.9 29.5,40.9 29.5,39.9 29.8,38.9 30.5,38.1 31.5,37.7 32.6,37.7 33.6,37.7 34.6,37.7 35.7,37.7 31.3,45.4 31.3,44.6 31.3,43.7 31.3,42.8 31.3,40.9 31.3,39.9 31.9,39.2 33,39.1 34.1,39.1 35.2,39.1 36.3,39.1 37.3,39.3 37.3,40.3 38.3,41.2 39.1,38.7 39.8,39.3 41.6,39.9 41.6,40.9 41.6,41.9 41.6,42.9 41.7,44.6 43.4,40 41.7,45.4 43.4,40.9 43.4,41.9 43.4,43 41.6,43.8 40.6,39.7 39.8,37 40.3,37.9 41.3,38.4 42.3,38.3 43.4,38.3 15.1,9.3 15.1,6 0.7,0.7 0.7,3.4 7.8,25.3 20.7,30.6
  pour Bottom: 0,50 0,0 50,0 50,50
  pour Top: 0,50 0,0 50,0 50,50
MISO
  Top 0.254: U$1.3 21.63,7.93 20.3,6.6 20.3,3.6 19.4,2.7 17.51,2.7 J1.4
MOSI
  Top 0.254: U$1.4 22.13,7.73 20.8,6.4 20.8,3.2 19.9,2.3 19.9,2.29 J1.3
N$1
  Top 0.254: U$2.20 15.23,32.13 R30.1
N$2
  Top 0.254: U$1.36 26.63,18.73 29.3,21.4 35.8,21.4 39.2,24.8 39.2,26.16 R45.2
N$3
  Top 0.254: U$1.37 26.13,19.13 27.2,20.2 27.2,20.71 R3.2
N$4
  Top 0.254: U$1.38 25.63,19.53 26.3,20.2 26.3,20.82 R4.2
N$5
  Top 0.254: U$1.44 22.63,20.07 20.9,21.8 14.2,21.8 12.1,23.9 12.1,26.3 12.4,26.6 R34.2
N$6
  Top 0.254: U$1.46 21.63,19.47 20.6,20.5 20.04,20.5 R7.2
N$7
  Top 0.254: U$1.47 21.13,18.77 20.6,19.3 19.96,19.3 R8.2
N$8
  Top 0.254: U$1.45 22.13,19.77 20.6,21.3 14,21.3 11.5,23.8 R35.2
N$9
  Top 0.254: U$1.34 27.63,18.43 28.2,19 28.95,19 R9.2
N$10
  Top 0.254: U$1.6 23.13,7.43 22.3,6.6 22.3,6.25 R10.2
N$11
  Top 0.254: U$1.27 31.9,14.5 33.3,15.9 R1.1
N$12
  Top 0.254: U$1.54 10.6,14.5 R11.1
N$13
  Top 0.254: U$1.55 11.2,14 R12.1
N$14
  Top 0.254: U$1.56 11.91,13.5 R13.1
N$15
  Top 0.254: U$1.57 12.62,13 R14.1
N$16
  Top 0.254: U$1.58 13.23,12.5 R15.1
N$17
  Top 0.254: D1.+ 8.06,12.91 R11.2
N$18
  Top 0.254: D2.+ 7.96,11.71 R12.2
N$19
  Top 0.254: D4.+ 7.99,9.31 R14.2
N$20
  Top 0.254: D5.+ 8,8.21 R15.2
N$21
  Top 0.254: D3.+ 7.98,10.51 R13.2
N$22
  Top 0.254: 25.33,20.88 R16.1 25.5,20.73 25.5,20 25.13,19.63 U$1.39
N$23
  Top 0.254: U$1.28 31.7,15 33.7,17 34.74,17 R17.1
N$24
  Top 0.254: U$1.13 26.63,7.87 27.5,7 27.5,6.29 R18.1
N$25
  Top 0.254: U$1.15 27.63,8.17 28.7,7.1 29.4,7.1 29.6,6.9 R2.1
N$26
  Top 0.254: U$1.14 27.13,7.97 28.3,6.8 28.3,6.5 R19.1
N$27
  Top 0.254: U$1.26 32.1,14 32.9,14.8 R5.1
N$29
  Top 0.254: U$2.8 4.54,30.63 C19.1
N$30
  Top 0.254: U$1.53 12.88,15 arc-90 R21.2
N$31
  Top 0.254: U1.3 R21.1
N$32
  Top 0.254: R22.2 4.06,13.46 4.5,13.9 4.5,14.53 U1.1
N$33
  Top 0.254: R23.2 2.56,16.9 | 2.56,16.9 C10.1 1.9,16.9 1.7,16.7 1.7,14.5 2.13,14.07 R22.1 | 2.56,16.9 4.57,16.9 U1.4
N$34
  Top 0.254: U2.1 22.93,26.23 22.7,26 21.55,26 R24.2
N$35
  Top 0.254: U$2.1 6.97,34.13 5.6,35.5 C11.1
N$36
  Top 0.254: C18.1 23.23,29.73 U2.4 22.92,28.21 R25.2 R24.1
N$37  (via drill 0.33)
  Top 0.254: C34.2 26.51,30.31 26.6,30.3 | 26.4,30.1 26.4,28.86 U2.3 | 26.4,30.4 25.4,31.4 19.5,31.4 18.7,30.6 18.7,25.8 19.6,24.9 19.6,23.9 18.5,22.8 14.7,22.8 13.2,24.3 v13.2,25.6 | 26.6,30.3 26.5,30.3 26.4,30.4 | 26.4,30.4 26.4,30.1 | 26.4,30.1 26.6,30.3 | C19.2 3.7,30.57 3.7,29.8 4,29.5 4.9,29.5 5.3,29.9 7.5,29.9 7.8,29.6 7.8,27.3 v9.3,25.6
  Bottom 0.254: v9.3,25.6 v13.2,25.6
N$38
  Top 0.254: U$2.25 12.41,35.6 C15.1
N$39
  Top 0.254: U$2.3 4.69,33.13 C16.1
N$40
  Top 0.254: U$2.5 7.53,32.13 7,31.6 6.3,31.6 5.9,32 4.63,32 C17.1
N$41
  Top 0.254: U$2.24 13.53,34.13 14.5,35.1 14.5,36.1 14.8,36.4 15.35,36.4 R26.1
N$42
  Top 0.254: U$2.23 13.83,33.63 14.9,34.7 14.9,34.72 R27.1
N$43
  Top 0.254: U$2.22 14.13,33.13 14.9,33.9 15.18,33.9 R28.1
N$44
  Top 0.254: U$2.21 14.33,32.63 14.7,33 R29.1
N$45
  Top 0.254: R26.2 17.38,36.36 D6.+
N$46
  Top 0.254: R28.2 17.34,34.1 D8.+
N$47
  Top 0.254: R29.2 17.33,33 D9.+
N$48
  Top 0.254: R27.2 17.35,35.2 D7.+
N$49
  Top 0.254: U$2.27 11.41,36.81 arc-90 14.1,39.5 17.67,39.5 arc-90 L1.2 arc90 17.7,39.51 17.7,40.6 arc90 17.69,40.59 L2.1
N$50
  Top 0.254: L2.2 17.69,42.24 arc90 C20.2
N$51
  Top 0.254: C20.1 17.68,44.1 | 17.68,44.1 17.68,45.1 | 17.68,45.1 17.68,46.98 arc-90 17.8,47.1 17.8,47.91 arc90 J$1.SIG | C22.1 17.7,44.08 arc-90 17.68,44.1 | C21.1 17.75,45.17 arc-90 17.68,45.1
N$52
  Top 0.254: C23.2 arc-90 3.99,42.98 L3.2 3.99,41.95 arc-90 C24.1
N$53
  Top 0.254: U$2.30 9.91,38.99 arc90 C25.1 5.02,39.09 arc-90 L3.1
N$54
  Top 0.254: U$2.29 10.41,38.99 arc-90 C25.2 C26.1 arc-90 C26.1
N$55
  Top 0.254: C23.1 3.98,48.01 arc-90 J$2.SIG
N$56
  Top 0.254: R34.1 12.4,28.4 11.9,28.9 U$2.15
N$57
  Top 0.254: U$2.14 11.41,28.18 R35.1
N$58
  Top 0.254: U$3.1 34.97,33.83 34.2,34.6 32.45,34.6 C27.1
N$59
  Top 0.152: C31.1 40.75,35.5 40,34.75 U$3.25
N$60
  Top 0.254: U$3.3 33.33,32.83 33,32.5 32.45,32.5 C32.1
N$61
  Top 0.254: U$3.5 35.13,31.83 34.7,31.4 32.45,31.4 C33.1
N$62
  Top 0.254: U$3.8 32.47,30.33 C34.1
N$63
  Top 0.254: U$3.24 41.13,33.83 42.5,35.2 42.5,35.6 42.7,35.8 43.1,35.8 R36.1
N$64
  Top 0.254: U$3.23 41.43,33.33 42.7,34.6 42.99,34.6 R37.1
N$65
  Top 0.254: U$3.22 41.73,32.83 42.6,33.7 43.15,33.7 R38.1
N$66
  Top 0.254: R39.1 42.44,32.74 42.03,32.33 U$3.21
N$67
  Top 0.254: R36.2 45.02,35.9 D10.+
N$68
  Top 0.254: R38.2 44.99,33.74 D12.+
N$69
  Top 0.254: R39.2 44.99,32.74 D13.+
N$70
  Top 0.254: R37.2 45.01,34.8 D11.+
N$71
  Top 0.254: L5.1 42.49,39.1 L4.2 arc90 42.49,39.1 41.5,39.1 arc90 39.06,36.66 U$3.27
N$72
  Top 0.254: L5.2 C35.2
N$73
  Top 0.152: C37.1 42.5,44 42.52,44
  Top 0.254: C35.1 42.52,42.81 42.52,44 C36.1 42.52,47.91 J$3.SIG
N$74
  Top 0.152: C39.1 30.5,41.9
  Top 0.254: L6.2 C39.1 30.39,42.91 arc-90 C38.2
N$75
  Top 0.254: U$3.30 37.56,38.32 arc90 C40.1 31.98,38.4 arc-90 L6.1
N$76
  Top 0.254: U$3.29 38.06,38.3 arc90 C40.2 38.26,39.33 arc-90 C41.1
N$77
  Top 0.254: C38.1 30.4,47.61 arc-90 J$4.SIG
N$78
  Top 0.254: U$3.15 39.56,28.34 40.2,27.7 40.2,27.11 R44.1
N$79
  Top 0.254: U$3.14 39.06,27.27 arc90 R45.1
N$80  (via drill 0.33)
  Top 0.254: R33.2 16.4,29.2 16.7,28.9 16.7,24.3 v16.3,23.8 | v15.4,10.3 17.5,10.3 18.2,11 U$1.61
  Bottom 0.254: v16.3,23.8 16.3,23.5 16.7,23.1 16.7,11.7 v15.4,10.3
N$81  (via drill 0.33)
  Top 0.254: R32.2 16.9,30.1 17.2,29.8 17.2,23.9 v17.1,23.7 | v16.7,9.5 17.5,9.5 18.5,10.5 U$1.62
  Bottom 0.254: v17.1,23.7 17.2,23.6 17.2,10 v16.7,9.5
N$82  (via drill 0.33)
  Top 0.254: R31.2 16.9,31 17.7,30.2 17.7,24.8 18.1,24.4 v18.1,23.8 | v17.1,8.6 17.4,8.6 18.8,10 U$1.63
  Bottom 0.254: v18.1,23.8 18.1,23.5 17.7,23.1 17.7,9.1 v17.1,8.6
N$83  (via drill 0.33)
  Top 0.254: R30.2 16.8,31.9 18.2,30.5 18.2,25.1 v19,24.3 | v17.8,8 17.8,8.1 19.2,9.5 U$1.64
  Bottom 0.254: v19,24.3 19,23.7 18.2,22.9 18.2,8.4 v17.8,8
N$84
  Top 0.254: U$1.22 44.4,12 46.8,14.4 46.8,27.1 44.9,28.9 44.08,28.9 R43.2
N$85
  Top 0.254: R42.2 44.86,29.84 47.3,27.6 47.3,14.1 44.7,11.5 U$1.21
N$86
  Top 0.254: U$1.20 45,11 47.8,13.8 47.8,28 44.8,30.9 44.01,30.9 R41.2
N$87
  Top 0.254: R40.2 44.86,31.84 48.3,28.5 48.3,13.4 45.3,10.5 U$1.19
N$88  (via drill 0.33)
  Top 0.254: U$1.25 32.3,13.5 32.8,14 36.3,14 36.5,14.2 36.5,17.5 36.1,17.9 33.5,17.9 33.3,18.1 33.3,19.6 v33.4,19.7 | U$2.9 8.91,29.01 v8.6,28.7 | v19.4,30.4 19.4,28.6 20.6,27.3 20.6,25.1 22.8,22.9 33.1,22.9 | U$3.9 36.56,28.84 37.5,27.9 37.5,25.5 34.9,22.9 33.1,22.9 | 33.1,22.9 v33.1,23.1
  Bottom 0.254: v33.4,19.7 33,20.1 33,22.9 33.1,23 v33.1,23.1 | v8.6,28.7 17.5,28.7 v19.4,30.4
N$89  (via drill 0.33)
  Top 0.254: R16.2 23.18,21.72 23.12,21.77 23.1,21.8 20.1,24.8 20.1,26.9 v19.4,27.6 | U$2.11 9.91,24.61 v9.7,24.4
  Bottom 0.254: v9.7,24.4 13,24.4 16,27.4 19.2,27.4 v19.4,27.6
N$90
  Top 0.254: U$1.35 27.13,18.63 29.4,20.9 36.1,20.9 40.2,25 40.2,26.14 R44.2
N$91
  Top 0.254: R7.1 14.18,20.42 10.9,23.7 U$2.13
N$92
  Top 0.254: R3.1 27.61,21.71 27.8,21.9 35.5,21.9 38.56,24.96 U$3.13
N$93
  Top 0.254: U$3.12 38.06,25.26 35.2,22.4 26.5,22.4 26.3,22.2 26.3,21.74 R4.1
N$94
  Top 0.254: R8.1 14.48,19.32 10.4,23.4 U$2.12
N$100
  Top 0.254: U$2.19 14.17,31.63 14.9,30.9 15.35,30.9 R31.1
N$101
  Top 0.254: U$2.18 13.87,31.13 14.8,30.2 15.34,30.2 R32.1
N$102
  Top 0.254: U$2.17 13.27,30.63 14.8,29.1 15.32,29.1 R33.1
N$103
  Top 0.254: U$3.20 43.16,31.83 R40.1
N$104
  Top 0.254: U$3.19 41.97,31.33 42.4,30.9 43.1,30.9 R41.1
N$105
  Top 0.254: U$3.18 41.57,30.83 42.6,29.8 43.1,29.8 R42.1
N$106
  Top 0.254: U$3.17 41.27,30.33 42.6,29 42.98,29 R43.1
PPS
  Top 0.254: U$1.9 24.63,7.07 24.8,6.9 24.8,4.12 R20.2 23.93,1.25 J1.1
RST
  Top 0.254: U$1.1 20.63,8.23 19.3,6.9 19.3,4.1 18.9,3.7 13.43,3.7 J1.6
SCK
  Top 0.254: U$1.2 21.13,8.03 19.8,6.7 19.8,3.8 19.2,3.2 15.73,3.2 J1.5

### Text on the board
tPlace: TX | RX | TX | RX | Channel A | Channel B | 5V | GND | RST | SCK | MISO | MOSI | CS | PPS
bNames: LoRa Board / design by Will Whang / 2016/07/29